# Altium schematic sheet J3.schdoc: TEBF0808 - B2B-connector J3
size A4; DocumentNumber: TEBF0808; Revision: 04; SheetNumber: 5; SheetTotal: 36; Date: 2016-09-29; CompanyName: Trenz Electronic GmbH; Organization: Trenz Electronic GmbH
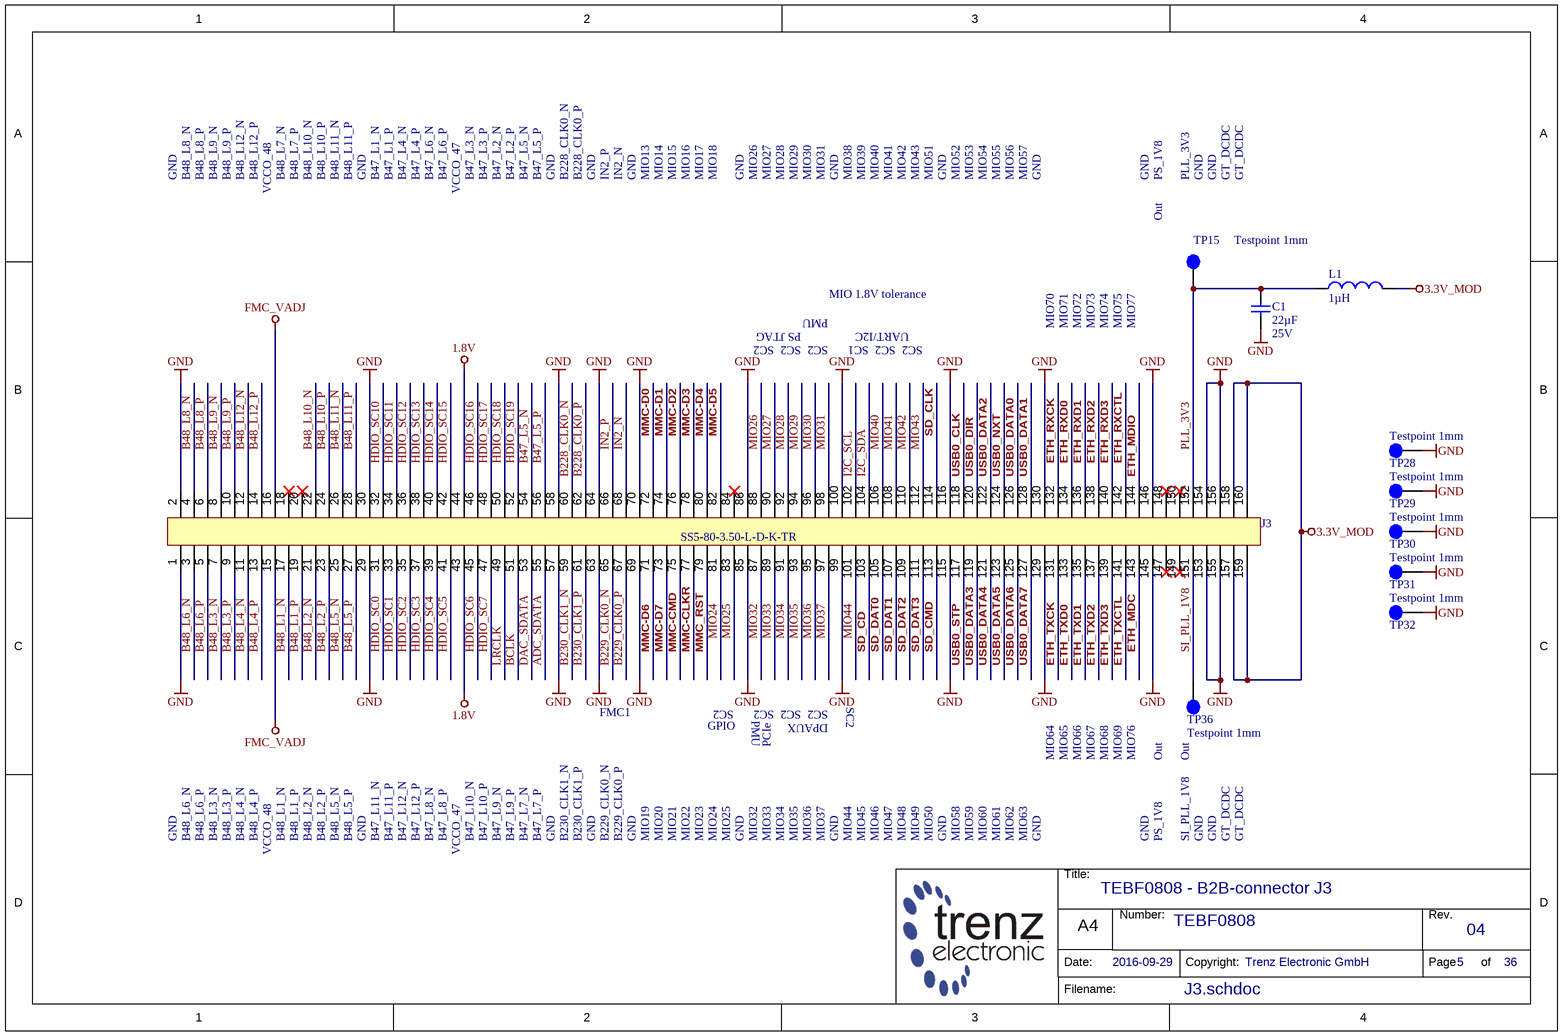
[diagram p0: J3.schdoc]

## Parts
C1  22µF  Voltage: 25V  [CAPC3216X180N]
J3  SS5-80-3.50-L-D-K-TR  [SS5-80-3.50-L-D-K-TR]
L1  1µH  [INDC2520X100N]
TP15  Testpoint 1mm  [TP_1mm]
TP28  Testpoint 1mm  [TP_1mm]
TP29  Testpoint 1mm  [TP_1mm]
TP30  Testpoint 1mm  [TP_1mm]
TP31  Testpoint 1mm  [TP_1mm]
TP32  Testpoint 1mm  [TP_1mm]
TP36  Testpoint 1mm  [TP_1mm]

## Nets
1.8V: J3.43 J3.44
3.3V_MOD: J3.157 J3.158 J3.159 J3.160 L1.2
FMC_VADJ: J3.15 J3.16
GND: C1.1 J3.1 J3.2 J3.29 J3.30 J3.57 J3.58 J3.63 J3.64 J3.69 J3.70 J3.85 J3.86 J3.99 J3.100 J3.115 J3.116 J3.129 J3.130 J3.145 J3.146 J3.153 J3.154 J3.155 J3.156 TP28.1 TP29.1 TP30.1 TP31.1 TP32.1
ADC_SDATA: J3.55
B47_L5_N: J3.54
B47_L5_P: J3.56
B48_L1_N: J3.17
B48_L1_P: J3.19
B48_L2_N: J3.21
B48_L2_P: J3.23
B48_L3_N: J3.7
B48_L3_P: J3.9
B48_L4_N: J3.11
B48_L4_P: J3.13
B48_L5_N: J3.25
B48_L5_P: J3.27
B48_L6_N: J3.3
B48_L6_P: J3.5
B48_L8_N: J3.4
B48_L8_P: J3.6
B48_L9_N: J3.8
B48_L9_P: J3.10
B48_L10_N: J3.22
B48_L10_P: J3.24
B48_L11_N: J3.26
B48_L11_P: J3.28
B48_L12_N: J3.12
B48_L12_P: J3.14
B228_CLK0_N: J3.60
B228_CLK0_P: J3.62
B229_CLK0_N: J3.65
B229_CLK0_P: J3.67
B230_CLK1_N: J3.59
B230_CLK1_P: J3.61
BCLK: J3.51
DAC_SDATA: J3.53
ETH_MDC: J3.143
ETH_MDIO: J3.144
ETH_RXCK: J3.132
ETH_RXCTL: J3.142
ETH_RXD0: J3.134
ETH_RXD1: J3.136
ETH_RXD2: J3.138
ETH_RXD3: J3.140
ETH_TXCK: J3.131
ETH_TXCTL: J3.141
ETH_TXD0: J3.133
ETH_TXD1: J3.135
ETH_TXD2: J3.137
ETH_TXD3: J3.139
HDIO_SC0: J3.31
HDIO_SC1: J3.33
HDIO_SC2: J3.35
HDIO_SC3: J3.37
HDIO_SC4: J3.39
HDIO_SC5: J3.41
HDIO_SC6: J3.45
HDIO_SC7: J3.47
HDIO_SC10: J3.32
HDIO_SC11: J3.34
HDIO_SC12: J3.36
HDIO_SC13: J3.38
HDIO_SC14: J3.40
HDIO_SC15: J3.42
HDIO_SC16: J3.46
HDIO_SC17: J3.48
HDIO_SC18: J3.50
HDIO_SC19: J3.52
I2C_SCL: J3.102
I2C_SDA: J3.104
IN2_N: J3.68
IN2_P: J3.66
LRCLK: J3.49
MIO24: J3.81
MIO25: J3.83
MIO26: J3.88
MIO27: J3.90
MIO28: J3.92
MIO29: J3.94
MIO30: J3.96
MIO31: J3.98
MIO32: J3.87
MIO33: J3.89
MIO34: J3.91
MIO35: J3.93
MIO36: J3.95
MIO37: J3.97
MIO40: J3.106
MIO41: J3.108
MIO42: J3.110
MIO43: J3.112
MIO44: J3.101
MMC-CLKR: J3.77
MMC-CMD: J3.75
MMC-D0: J3.72
MMC-D1: J3.74
MMC-D2: J3.76
MMC-D3: J3.78
MMC-D4: J3.80
MMC-D5: J3.82
MMC-D6: J3.71
MMC-D7: J3.73
MMC_RST: J3.79
PLL_3V3: C1.2 J3.152 L1.1 TP15.1
SD_CD: J3.103
SD_CLK: J3.114
SD_CMD: J3.113
SD_DAT0: J3.105
SD_DAT1: J3.107
SD_DAT2: J3.109
SD_DAT3: J3.111
SI_PLL_1V8: J3.151 TP36.1
USB0_CLK: J3.118
USB0_DATA0: J3.126
USB0_DATA1: J3.128
USB0_DATA2: J3.122
USB0_DATA3: J3.119
USB0_DATA4: J3.121
USB0_DATA5: J3.123
USB0_DATA6: J3.125
USB0_DATA7: J3.127
USB0_DIR: J3.120
USB0_NXT: J3.124
USB0_STP: J3.117

Not connected (* = marked no-connect by the designer): J3 18* 20* 84* 147* 148* 149* 150*

## Notes on the sheet
- GND
- B48_L8_N
- B48_L8_P
- B48_L9_N
- B48_L9_P
- B48_L12_N
- B48_L12_P
- B48_L7_N
- B48_L7_P
- B48_L10_N
- B48_L10_P
- B48_L11_N
- B48_L11_P
- B47_L1_N
- B47_L1_P
- B47_L4_N
- B47_L4_P
- B47_L6_N
- B47_L6_P
- B47_L3_N
- B47_L3_P
- B47_L2_N
- B47_L2_P
- B47_L5_N
- B47_L5_P
- B228_CLK0_N
- B228_CLK0_P
- IN2_P
- IN2_N
- MIO13
- MIO14
- MIO15
- MIO16
- MIO17
- MIO18
- MIO26
- MIO27
- MIO28
- MIO29
- MIO30
- MIO31
- MIO38
- MIO39
- MIO40
- MIO41
- MIO42
- MIO43
- MIO51
- MIO52
- MIO53
- MIO54
- MIO55
- MIO56
- MIO57
- PS_1V8
- PLL_3V3
- GT_DCDC
- VCCO_48
- VCCO_47
- (near TP15) Out
- MIO 1.8V tolerance
- PMU
- SC2
- PS JTAG
- SC1
- UART/I2C
- MIO70
- MIO71
- MIO72
- MIO73
- MIO74
- MIO75
- MIO77
- FMC1
- DPAUX
- GPIO
- PCIe
- MIO64
- MIO65
- MIO66
- MIO67
- MIO68
- MIO69
- MIO76
- (near TP36) Out
- B48_L6_N
- B48_L6_P
- B48_L3_N
- B48_L3_P
- B48_L4_N
- B48_L4_P
- B48_L1_N
- B48_L1_P
- B48_L2_N
- B48_L2_P
- B48_L5_N
- B48_L5_P
- B47_L11_N
- B47_L11_P
- B47_L12_N
- B47_L12_P
- B47_L8_N
- B47_L8_P
- B47_L10_N
- B47_L10_P
- B47_L9_N
- B47_L9_P
- B47_L7_N
- B47_L7_P
- B230_CLK1_N
- B230_CLK1_P
- B229_CLK0_N
- B229_CLK0_P
- MIO19
- MIO20
- MIO21
- MIO22
- MIO23
- MIO24
- MIO25
- MIO32
- MIO33
- MIO34
- MIO35
- MIO36
- MIO37
- MIO44
- MIO45
- MIO46
- MIO47
- MIO48
- MIO49
- MIO50
- MIO58
- MIO59
- MIO60
- MIO61
- MIO62
- MIO63
- SI_PLL_1V8
- Title:
- Number:
- Rev.
- Date:
- A4
- Copyright:
- Page
- of
- Filename:

## Library data of the parts
C1 = 24886: KON 22µF X5R 25V SMD 10%; AN: 24886; Value: 22u; Mixed: SMT; Preferred: Yes; Case: 3216 (1206); Tolerance: 10%
J3 = 27219: Samtec Ultra Fine Pitch Socket REF192552-01, 160 Pins; AN: 27219; Mixed: SMT; Preferred: Yes; HelpURL: B:\ad\adlib\datasheet\SS5-XX-X.XX-X-D-K-TR; H-ART: REF 192552-01
L1 = 25265: IND SMD 1µH +-20% 0.055Ohm; AN: 25265; Value: 1u; Trenz-Stock: Yes; Voltage: 1.7A; Mixed: SMT; H-ART: 74479787210a; Case: WE-PMI 2520(1008); HelpURL: B:\AD\adlib\datasheet\74479787210a; Technology: 0.055Ohm
TP15 TP28-TP32 TP36 = 25063: AN: 25063; Mixed: SMT